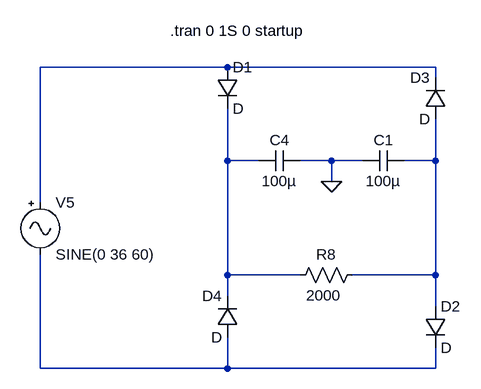
[diagram p0: schematic powerSupply.asc]
powerSupply.asc, the LTspice schematic file:
Version 4
SHEET 1 880 680
WIRE -832 -208 -1120 -208
WIRE -512 -208 -832 -208
WIRE -512 -192 -512 -208
WIRE -832 -64 -832 -144
WIRE -784 -64 -832 -64
WIRE -672 -64 -720 -64
WIRE -624 -64 -672 -64
WIRE -512 -64 -512 -128
WIRE -512 -64 -560 -64
WIRE -672 -32 -672 -64
WIRE -1120 0 -1120 -208
WIRE -832 112 -832 -64
WIRE -720 112 -832 112
WIRE -512 112 -512 -64
WIRE -512 112 -640 112
WIRE -832 144 -832 112
WIRE -512 160 -512 112
WIRE -1120 256 -1120 80
WIRE -832 256 -832 208
WIRE -832 256 -1120 256
WIRE -512 256 -512 224
WIRE -512 256 -832 256
FLAG -672 -32 0
SYMBOL Misc\\signal -1120 -16 R0
WINDOW 123 0 0 Left 2
WINDOW 39 0 0 Left 2
SYMATTR InstName V5
SYMATTR Value SINE(0 36 60)
SYMBOL diode -848 -208 R0
SYMATTR InstName D1
SYMBOL diode -528 160 R0
SYMATTR InstName D2
SYMBOL diode -496 -128 R180
WINDOW 0 24 64 Left 2
WINDOW 3 24 0 Left 2
SYMATTR InstName D3
SYMBOL diode -816 208 R180
WINDOW 0 24 64 Left 2
WINDOW 3 24 0 Left 2
SYMATTR InstName D4
SYMBOL res -624 96 R90
WINDOW 0 0 56 VBottom 2
WINDOW 3 32 60 VTop 2
SYMATTR InstName R8
SYMATTR Value 2000
SYMBOL cap -720 -80 R90
WINDOW 0 0 32 VBottom 2
WINDOW 3 32 32 VTop 2
SYMATTR InstName C4
SYMATTR Value 100µ
SYMATTR SpiceLine V=16 Irms=1.06 Rser=0.0836489 Lser=0
SYMBOL cap -560 -80 R90
WINDOW 0 0 32 VBottom 2
WINDOW 3 32 32 VTop 2
SYMATTR InstName C1
SYMATTR Value 100µ
SYMATTR SpiceLine V=16 Irms=1.06 Rser=0.0836489 Lser=0
TEXT -920 -264 Left 2 !.tran 0 1S 0 startup

The netlist it stands for:
* powerSupply.asc
V5 N001 N004 SINE(0 36 60)
D1 N001 N002 D
D2 N003 N004 D
D3 N003 N001 D
D4 N004 N002 D
R8 N003 N002 2000
C4 0 N002 100µ V=16 Irms=1.06 Rser=0.0836489 Lser=0
C1 N003 0 100µ V=16 Irms=1.06 Rser=0.0836489 Lser=0
.model D D
.lib standard.dio
.tran 0 1S 0 startup
.backanno
.end